# EAGLE schematic gautebuoy (EAGLE 6.2)
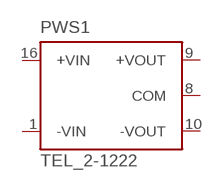
[diagram p0: schematic, sheet 1]

## Parts
PWS1  TEL_2-1222  [TRACOPOWER2W]
Unconnected: PWS1.1(-VIN) PWS1.8(COM) PWS1.9(+VOUT) PWS1.10(-VOUT) PWS1.16(+VIN)

## Library data of the parts
PWS1 = traco-electronic:TEL_2-: DC/DC-Konverter 2 Watt, 1 x Input, 1 x +- Output Source: http://www.tracopower.com/datasheet_g/tel2-d.pdf; MPN: TEL 2-1222; OC_FARNELL: 1007033; OC_NEWARK: 51R4761